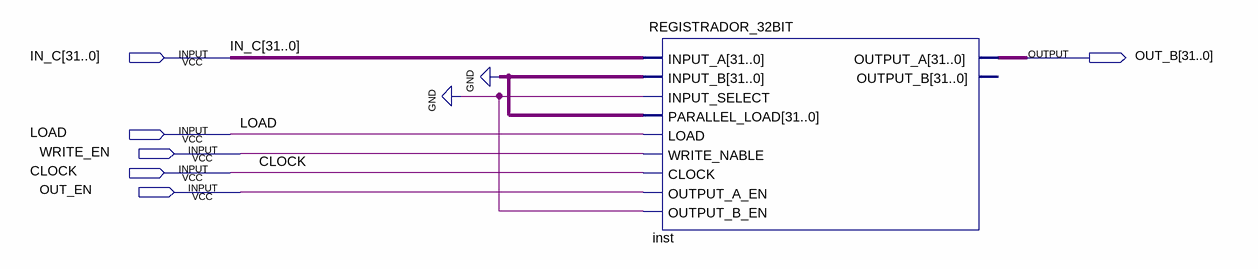
[diagram p0: schematic sheet]
// Quartus schematic OPC.bdf as structural Verilog: 1 symbols, 6 pins
module OPC (
  input  [31:0] IN_C,
  input  LOAD,
  input  WRITE_EN,
  input  CLOCK,
  input  OUT_EN,
  output [31:0] OUT_B
);

  REGISTRADOR_32BIT inst (
    .INPUT_A(IN_C), .INPUT_B({32{1'b0}}), .INPUT_SELECT(1'b0), .PARALLEL_LOAD({32{1'b0}}), .LOAD(LOAD),
    .WRITE_NABLE(WRITE_EN), .CLOCK(CLOCK), .OUTPUT_A_EN(OUT_EN), .OUTPUT_B_EN(1'b0), .OUTPUT_A(OUT_B));  // open: OUTPUT_B
endmodule
